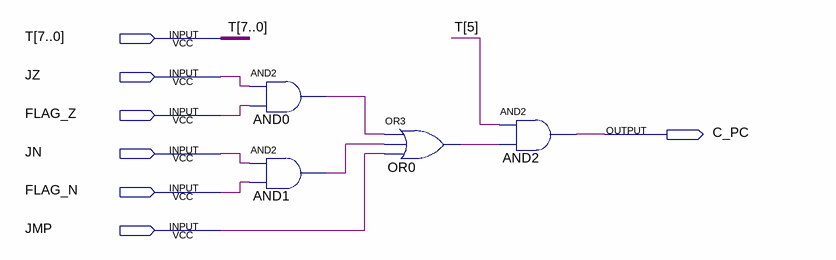
[diagram p0: schematic sheet]
// Quartus schematic C_PC.bdf as structural Verilog: 4 symbols, 7 pins
module C_PC (
  input  [7:0] T,
  input  JZ,
  input  FLAG_Z,
  input  JN,
  input  FLAG_N,
  input  JMP,
  output C_PC
);

  wire AND0_out, AND1_out, OR0_out;

  and AND0 (AND0_out, JZ, FLAG_Z);
  and AND1 (AND1_out, JN, FLAG_N);
  or OR0 (OR0_out, AND0_out, AND1_out, JMP);
  and AND2 (C_PC, T[5], OR0_out);
endmodule
